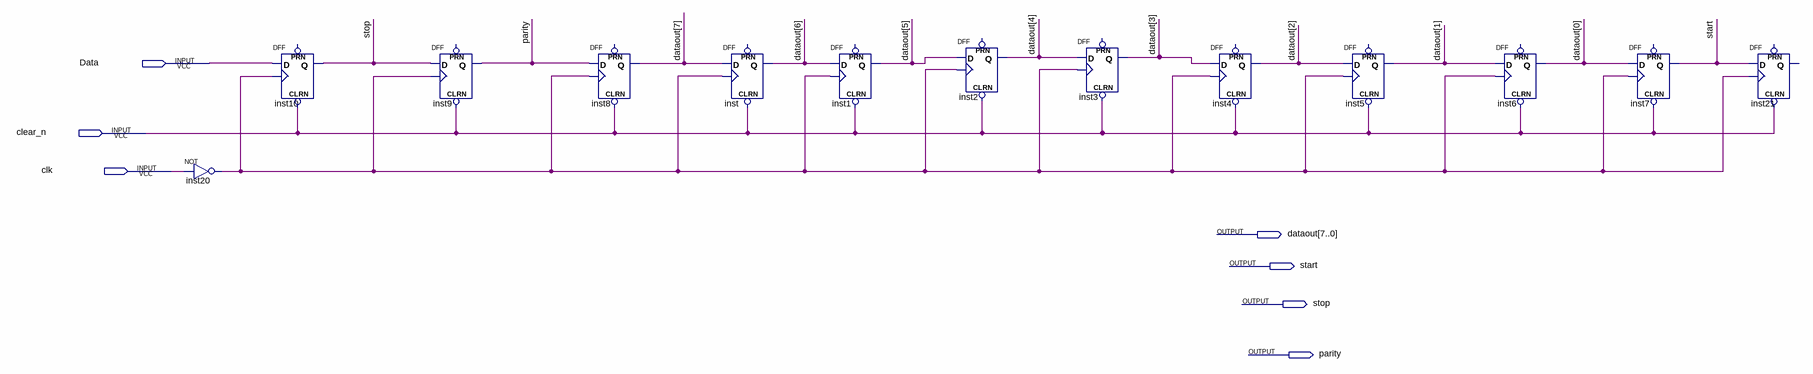
[diagram p0: schematic sheet]
// Quartus schematic shiftregister.bdf as structural Verilog: 13 symbols, 7 pins
module shiftregister (
  input  Data,
  input  clear_n,
  input  clk,
  output [7:0] dataout,
  output start,
  output stop,
  output parity
);

  wire inst20_out;

  not inst20 (inst20_out, clk);
  DFF inst10 (.CLRN(clear_n), .CLK(inst20_out), .D(Data), .Q(stop));  // open: PRN
  DFF inst9 (.CLRN(clear_n), .CLK(inst20_out), .D(stop), .Q(parity));  // open: PRN
  DFF inst8 (.CLRN(clear_n), .CLK(inst20_out), .D(parity), .Q(dataout[7]));  // open: PRN
  DFF inst (.CLRN(clear_n), .CLK(inst20_out), .D(dataout[7]), .Q(dataout[6]));  // open: PRN
  DFF inst1 (.CLRN(clear_n), .CLK(inst20_out), .D(dataout[6]), .Q(dataout[5]));  // open: PRN
  DFF inst2 (.CLRN(clear_n), .CLK(inst20_out), .D(dataout[5]), .Q(dataout[4]));  // open: PRN
  DFF inst3 (.CLRN(clear_n), .CLK(inst20_out), .D(dataout[4]), .Q(dataout[3]));  // open: PRN
  DFF inst4 (.CLRN(clear_n), .CLK(inst20_out), .D(dataout[3]), .Q(dataout[2]));  // open: PRN
  DFF inst5 (.CLRN(clear_n), .CLK(inst20_out), .D(dataout[2]), .Q(dataout[1]));  // open: PRN
  DFF inst6 (.CLRN(clear_n), .CLK(inst20_out), .D(dataout[1]), .Q(dataout[0]));  // open: PRN
  DFF inst7 (.CLRN(clear_n), .CLK(inst20_out), .D(dataout[0]), .Q(start));  // open: PRN
  DFF inst21 (.CLRN(clear_n), .CLK(inst20_out), .D(start));  // open: PRN, Q
endmodule
